# Altium schematic sheet Top_Level.SchDoc: AusBubble : Power : Top Level
size A4; DrawnBy: WR, ND; DocumentNumber: 1; Revision: A; SheetNumber: 1; SheetTotal: 4